# EAGLE design Comunicador-RS485 (EAGLE 9.6.2)
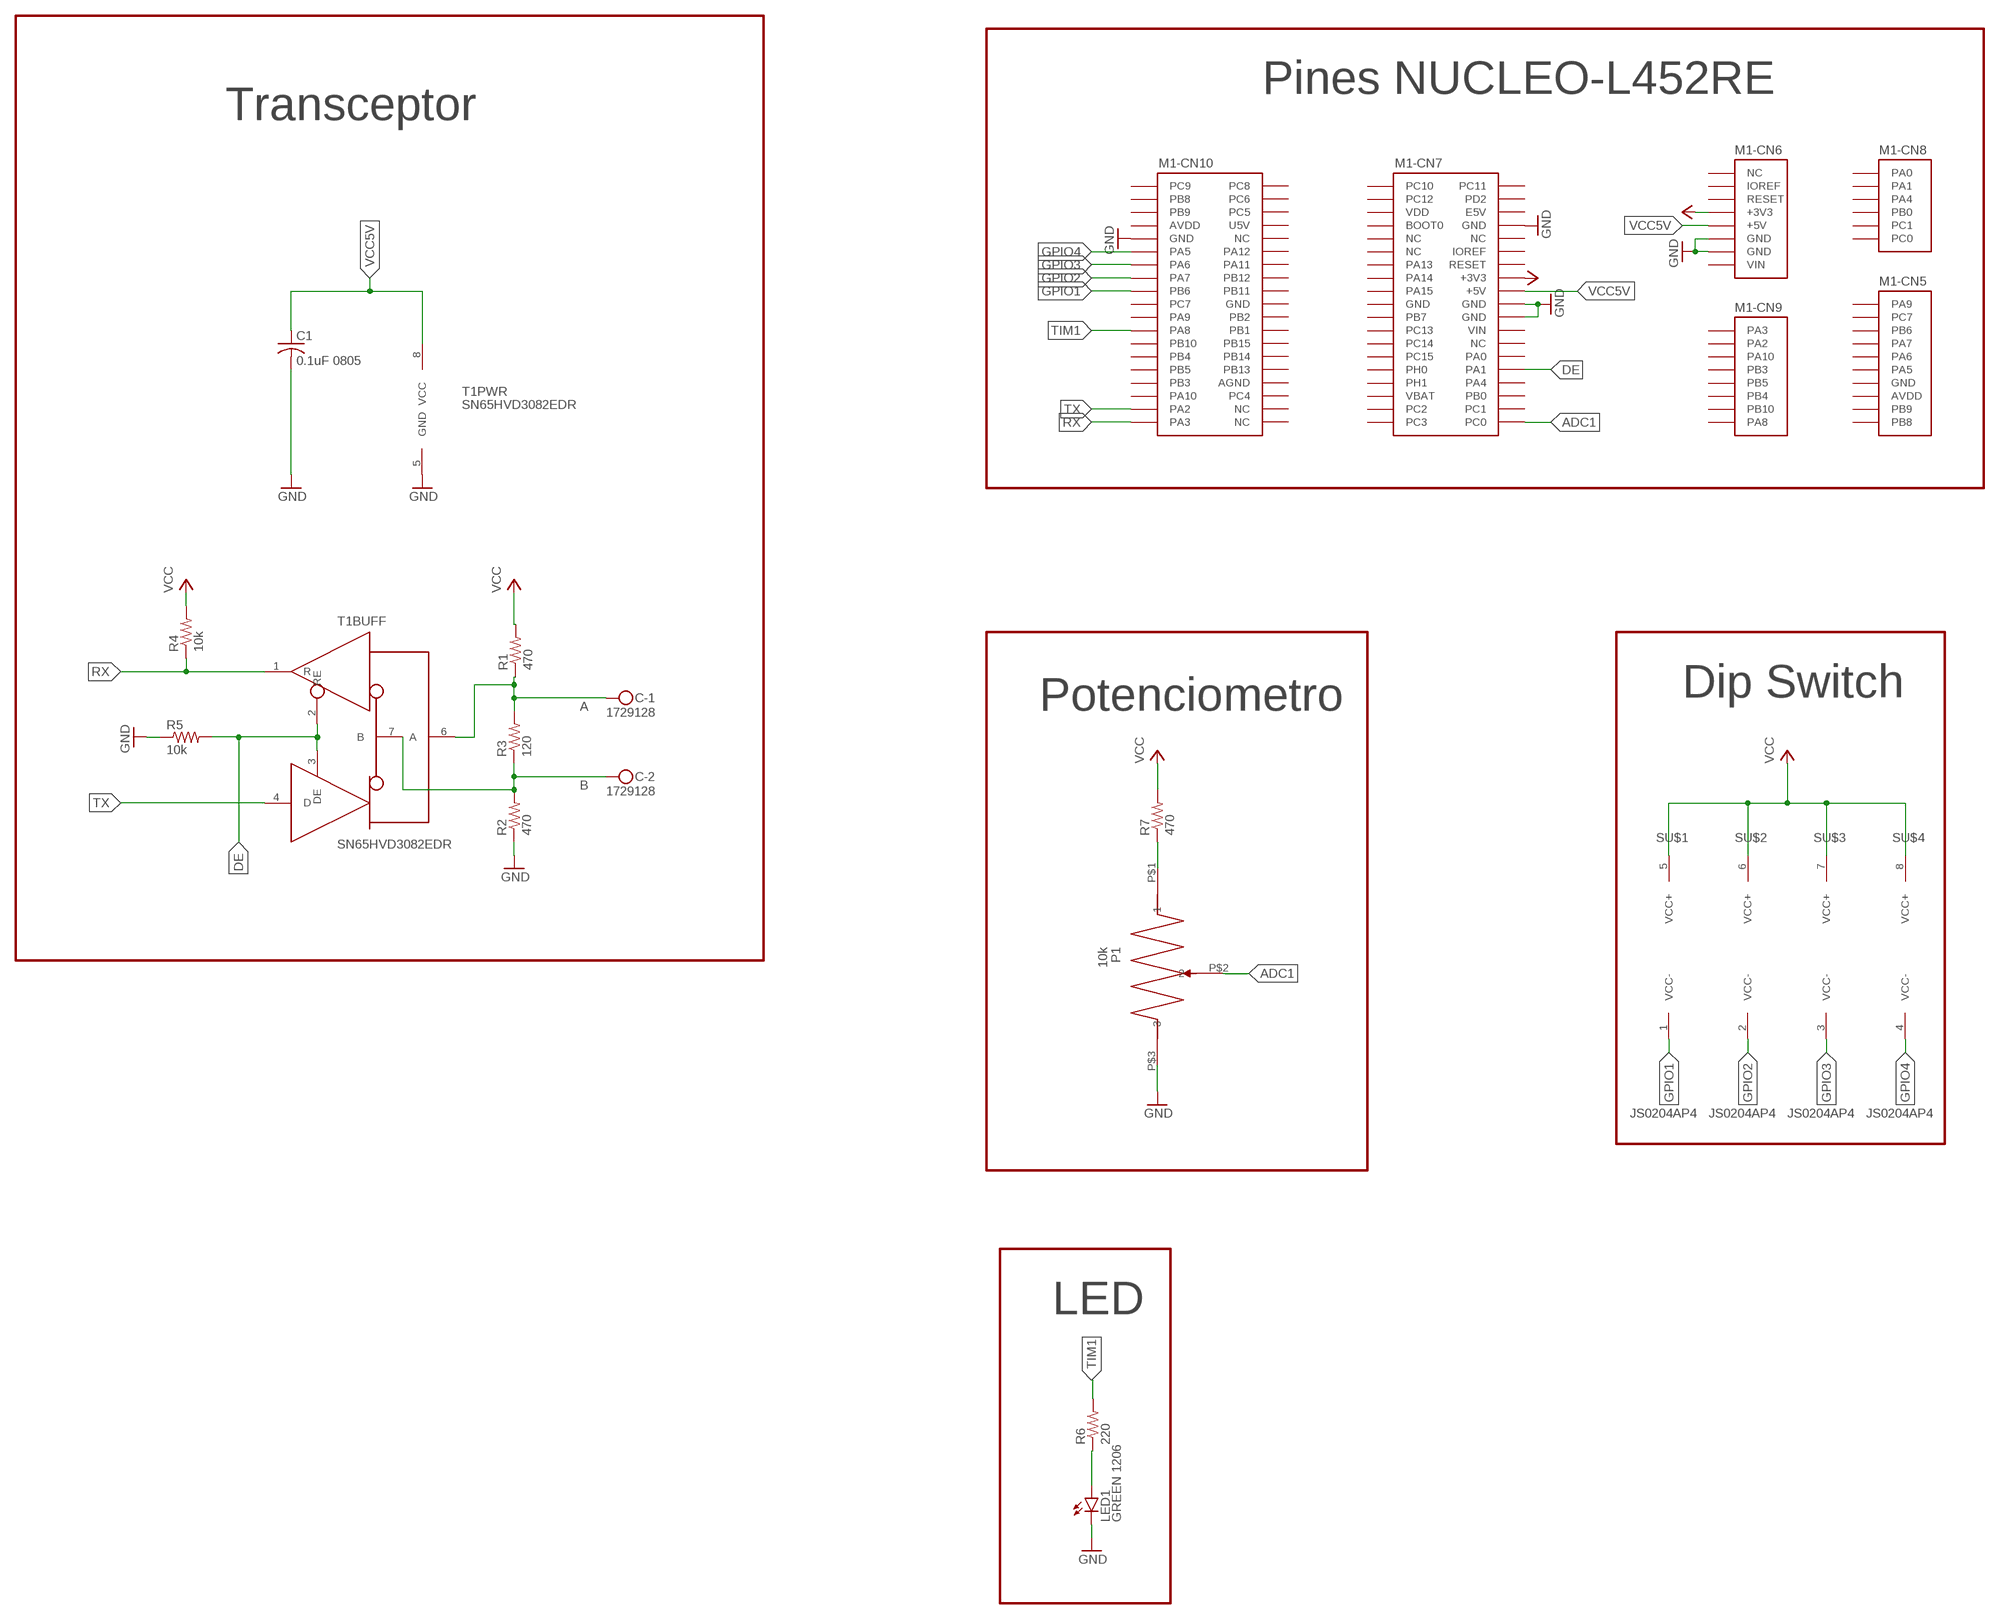
[diagram p0: schematic, sheet 1]

## Parts
C  1729128  MKDSN1,5/2-5,08  [MKDSN1,5/2-5,08]
C1  0.1uF 0805  C-USC0805  [C0805]
LED1  GREEN 1206  LEDCHIPLED_1206  [CHIPLED_1206]
M1  NUCLEO-L452RE  [NUCLEO-64]
P1  10k  PTV09A-4015U-B103  [PTV09A-4]
R1  470  R-US_R0805  [R0805]
R2  470  R-US_R0805  [R0805]
R3  120  R-US_R0805  [R0805]
R4  10k  R-US_R0805  [R0805]
R5  10k  R-US_R0805  [R0805]
R6  220  R-US_R0805  [R0805]
R7  470  R-US_R0805  [R0805]
S  JS0204AP4  [JS0204AP]
T1  SN65HVD3082EDR  [8-SOIC]

## Nets
A: C.1 R1.1 R3.2 T1.6(BUFF:A)
ADC1: M1.CN7-38(-CN7:PC0) P1.P$2
B: C.2 R2.2 R3.1 T1.7(BUFF:B)
DE: M1.CN7-30(-CN7:PA1) R5.2 T1.2(BUFF:RE) T1.3(BUFF:DE)
GND: C1.2 LED1.C M1.CN6-6(-CN6:GND) M1.CN6-7(-CN6:GND) M1.CN7-19(-CN7:GND) M1.CN7-20(-CN7:GND) M1.CN7-22(-CN7:GND) M1.CN10-9(-CN10:GND) P1.P$3 R2.1 R5.1 T1.5(PWR:GND)
GPIO1: M1.CN10-17(-CN10:PB6) S.1(U$1:VCC-)
GPIO2: M1.CN10-15(-CN10:PA7) S.2(U$2:VCC-)
GPIO3: M1.CN10-13(-CN10:PA6) S.3(U$3:VCC-)
GPIO4: M1.CN10-11(-CN10:PA5) S.4(U$4:VCC-)
N$1: LED1.A R6.1
N$14: P1.P$1 R7.1
RX: M1.CN10-37(-CN10:PA3) R4.1 T1.1(BUFF:R)
TIM1: M1.CN10-23(-CN10:PA8) R6.2
TX: M1.CN10-35(-CN10:PA2) T1.4(BUFF:D)
VCC: M1.CN6-4(-CN6:+3V3) M1.CN7-16(-CN7:+3V3) R1.2 R4.2 R7.2 S.5(U$1:VCC+) S.6(U$2:VCC+) S.7(U$3:VCC+) S.8(U$4:VCC+)
VCC5V: C1.1 M1.CN6-5(-CN6:+5V) M1.CN7-18(-CN7:+5V) T1.8(PWR:VCC)
Unconnected: M1.CN5-1(-CN5:PA9) M1.CN5-2(-CN5:PC7) M1.CN5-3(-CN5:PB6) M1.CN5-4(-CN5:PA7) M1.CN5-5(-CN5:PA6) M1.CN5-6(-CN5:PA5) M1.CN5-9(-CN5:PB9) M1.CN5-10(-CN5:PB8) M1.CN6-1(-CN6:NC) M1.CN6-3(-CN6:RESET) M1.CN7-1(-CN7:PC10) M1.CN7-2(-CN7:PC11) M1.CN7-3(-CN7:PC12) M1.CN7-4(-CN7:PD2) M1.CN7-6(-CN7:E5V) M1.CN7-7(-CN7:BOOT0) M1.CN7-9(-CN7:NC) M1.CN7-10(-CN7:NC) M1.CN7-11(-CN7:NC) M1.CN7-12(-CN7:IOREF) M1.CN7-13(-CN7:PA13) M1.CN7-14(-CN7:RESET) M1.CN7-15(-CN7:PA14) M1.CN7-17(-CN7:PA15) M1.CN7-21(-CN7:PB7) M1.CN7-23(-CN7:PC13) M1.CN7-25(-CN7:PC14) M1.CN7-26(-CN7:NC) M1.CN7-27(-CN7:PC15) M1.CN7-28(-CN7:PA0) M1.CN7-29(-CN7:PH0) M1.CN7-31(-CN7:PH1) M1.CN7-32(-CN7:PA4) M1.CN7-34(-CN7:PB0) M1.CN7-35(-CN7:PC2) M1.CN7-36(-CN7:PC1) M1.CN7-37(-CN7:PC3) M1.CN8-1(-CN8:PA0) M1.CN8-2(-CN8:PA1) M1.CN8-3(-CN8:PA4) M1.CN8-4(-CN8:PB0) M1.CN8-5(-CN8:PC1) M1.CN8-6(-CN8:PC0) M1.CN9-1(-CN9:PA3) M1.CN9-2(-CN9:PA2) M1.CN9-3(-CN9:PA10) M1.CN9-4(-CN9:PB3) M1.CN9-5(-CN9:PB5) M1.CN9-6(-CN9:PB4) M1.CN9-7(-CN9:PB10) M1.CN9-8(-CN9:PA8) M1.CN10-1(-CN10:PC9) M1.CN10-2(-CN10:PC8) M1.CN10-3(-CN10:PB8) M1.CN10-4(-CN10:PC6) M1.CN10-5(-CN10:PB9) M1.CN10-6(-CN10:PC5) M1.CN10-10(-CN10:NC) M1.CN10-12(-CN10:PA12) M1.CN10-14(-CN10:PA11) M1.CN10-16(-CN10:PB12) M1.CN10-18(-CN10:PB11) M1.CN10-19(-CN10:PC7) M1.CN10-21(-CN10:PA9) M1.CN10-22(-CN10:PB2) M1.CN10-24(-CN10:PB1) M1.CN10-25(-CN10:PB10) M1.CN10-26(-CN10:PB15) M1.CN10-27(-CN10:PB4) M1.CN10-28(-CN10:PB14) M1.CN10-29(-CN10:PB5) M1.CN10-30(-CN10:PB13) M1.CN10-31(-CN10:PB3) M1.CN10-33(-CN10:PA10) M1.CN10-34(-CN10:PC4) M1.CN10-36(-CN10:NC) M1.CN10-38(-CN10:NC)

## Notes on the sheet
- Pines NUCLEO-L452RE
- Transceptor
- Potenciometro | Dip Switch
- LED

## Power pins joined to a net without a drawn wire
AGND: M1.CN10-32(-CN10:AGND)
AVDD: M1.CN5-8(-CN5:AVDD) M1.CN10-7(-CN10:AVDD)
GND: M1.CN5-7(-CN5:GND) M1.CN7-8(-CN7:GND) M1.CN10-20(-CN10:GND)
IOREF: M1.CN6-2(-CN6:IOREF)
U5V: M1.CN10-8(-CN10:U5V)
VBAT: M1.CN7-33(-CN7:VBAT)
VDD: M1.CN7-5(-CN7:VDD)
VIN: M1.CN6-8(-CN6:VIN) M1.CN7-24(-CN7:VIN)

## Library data of the parts
C = 1729128 - PHOENIX CONTACT:MKDSN1,5/2-5,08: MKDSN 1,5/ 2-5,08 Printklemme Nennstrom: 13,5 A Nennspannung: 250 V Rastermaß: 5,08 mm Polzahl: 2 Anschlussart: Schraubanschluss Montage: Löten Anschlussrichtung Leiter/Platine: 0 ° Artikelnummer: 1729128 Source: http://eshop.phoenixcontact.com .. 1729128.pdf; PARTNO: 1729128
C1 = rcl:C-US: CAPACITOR, American symbol; PARTNO: 08053C104KAT2A; SPICEPREFIX: C
LED1 = QTLP650D4TR - Everlight Electronics:LED: LED OSRAM: - CHIPLED LG R971, LG N971, LY N971, LG Q971, LY Q971, LO R971, LY R971 LH N974, LH R974 LS Q976, LO Q976, LY Q976 LO Q996 - Hyper CHIPLED LW Q18S LB Q993, LB Q99A, LB R99A - SideLED LS A670, LO A670, LY A670, LG A670, LP A670 LB A673, LV A673, LT A673, LW A673 LH A674 LY A675 LS A676, LA A676, LO A676, LY A676, LW A676 LS A679, LY A679, LG A679 - Hyper Micro SIDELED® LS Y876, LA Y876, LO Y876, LY Y876 LT Y87S - SmartLED LW L88C, LW L88S LB L89C, LB L89S, LG L890 LS L89K, LO L89K, LY L89K LS L896, LA L896, LO L896, LY L896 - TOPLED LS T670, LO T670, LY T670, LG T670, LP T670 LSG T670, LSP T670, LSY T670, LOP T670, LYG T670 LG T671, LOG T671, LSG T671 LB T673, LV T673, LT T673, LW T673 LH T674 LS T676, LA T676, LO T676, LY T676, LB T676, LH T676, LSB T676, LW T676 LB T67C, LV T67C, LT T67C, LS T67K, LO T67K, LY T67K, LW E67C LS E67B, LA E67B, LO E67B, LY E67B, LB E67C, LV E67C, LT E67C LW T67C LS T679, LY T679, LG T679 LS T770, LO T770, LY T770, LG T770, LP T770 LB T773, LV T773, LT T773, LW T773 LH T774 LS E675, LA E675, LY E675, LS T675 LS T776, LA T776, LO T776, LY T776, LB T776 LHGB T686 LT T68C, LB T68C - Hyper Mini TOPLED® LB M676 - Mini TOPLED Santana® LG M470 LS M47K, LO M47K, LY M47K Source: http://www.osram.convergy.de LUXEON: - LUMILED® LXK2-PW12-R00, LXK2-PW12-S00, LXK2-PW14-U00, LXK2-PW14-V00 LXK2-PM12-R00, LXK2-PM12-S00, LXK2-PM14-U00 LXK2-PE12-Q00, LXK2-PE12-R00, LXK2-PE12-S00, LXK2-PE14-T00, LXK2-PE14-U00 LXK2-PB12-K00, LXK2-PB12-L00, LXK2-PB12-M00, LXK2-PB14-N00, LXK2-PB14-P00, LXK2-PB14-Q00 LXK2-PR12-L00, LXK2-PR12-M00, LXK2-PR14-Q00, LXK2-PR14-R00 LXK2-PD12-Q00, LXK2-PD12-R00, LXK2-PD12-S00 LXK2-PH12-R00, LXK2-PH12-S00 LXK2-PL12-P00, LXK2-PL12-Q00, LXK2-PL12-R00 Source: www.luxeon.com KINGBRIGHT: KA-3528ASYC Source: www.kingbright.com; PARTNO: CMD15-21VGD/TR8
M1 = NUCLEO-L452RE:NUCLEO-L452RE: No existe un outline (Layer Dimension) para esta librería. En su lugar se utilizó una referencia en tDocu. Al momento de diseñar la tarjeta, el Dimension debe ser dibujado según los requerimientos del usuario, o simplemente copiar los contenidos del tDocu en Dimensions.
P1 = PTV09A-4015U-B103 - BI:PTV09A-4015U-B103; PARTNO: PTV09A-4015U-B103
R1 R2 R7 = rcl:R-US_: RESISTOR, American symbol; PARTNO: AC0805FR-07470RL; SPICEPREFIX: R
R3 = rcl:R-US_: RESISTOR, American symbol; PARTNO: RC0805JR-13120RL; SPICEPREFIX: R
R4 R5 = rcl:R-US_: RESISTOR, American symbol; PARTNO: RC0805FR-0710KP; SPICEPREFIX: R
R6 = rcl:R-US_: RESISTOR, American symbol; PARTNO: AC0805FR-07220RL; SPICEPREFIX: R
S = JS0204AP4:JS0204AP4; PARTNO: JS0204AP4
T1 = SN65HVD3082EDR-TI:SN65HVD3082EDR; PARTNO: SN65HVD3082EDR

## Board
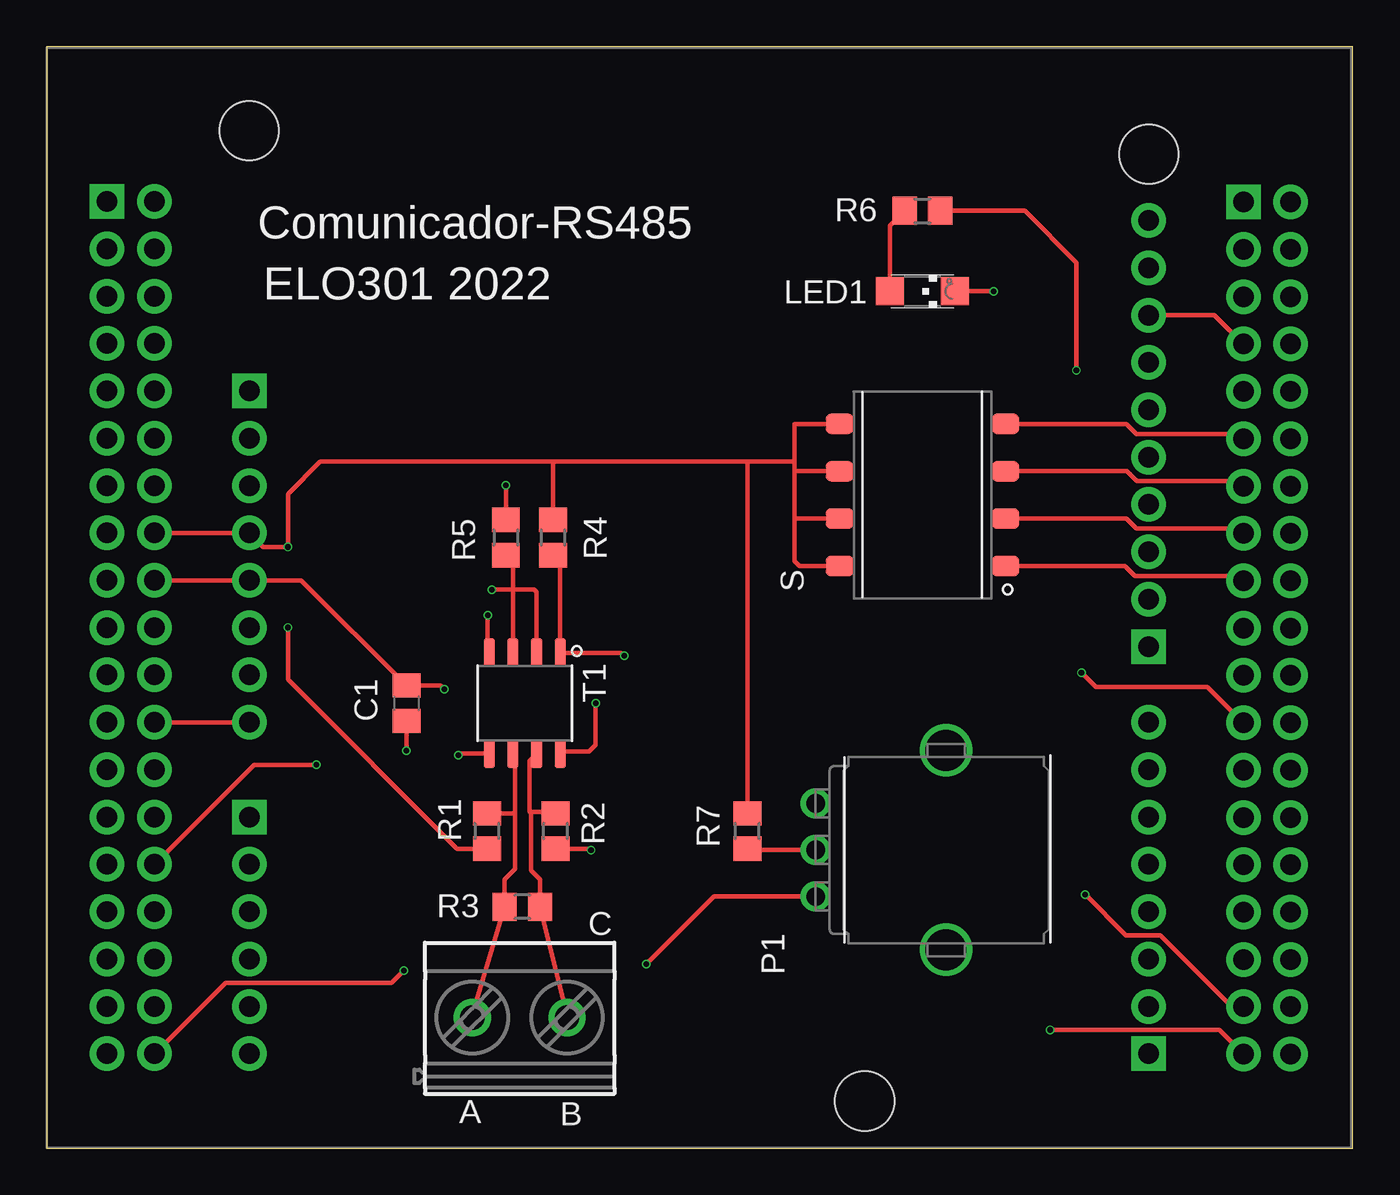
[diagram p1: board, top side]
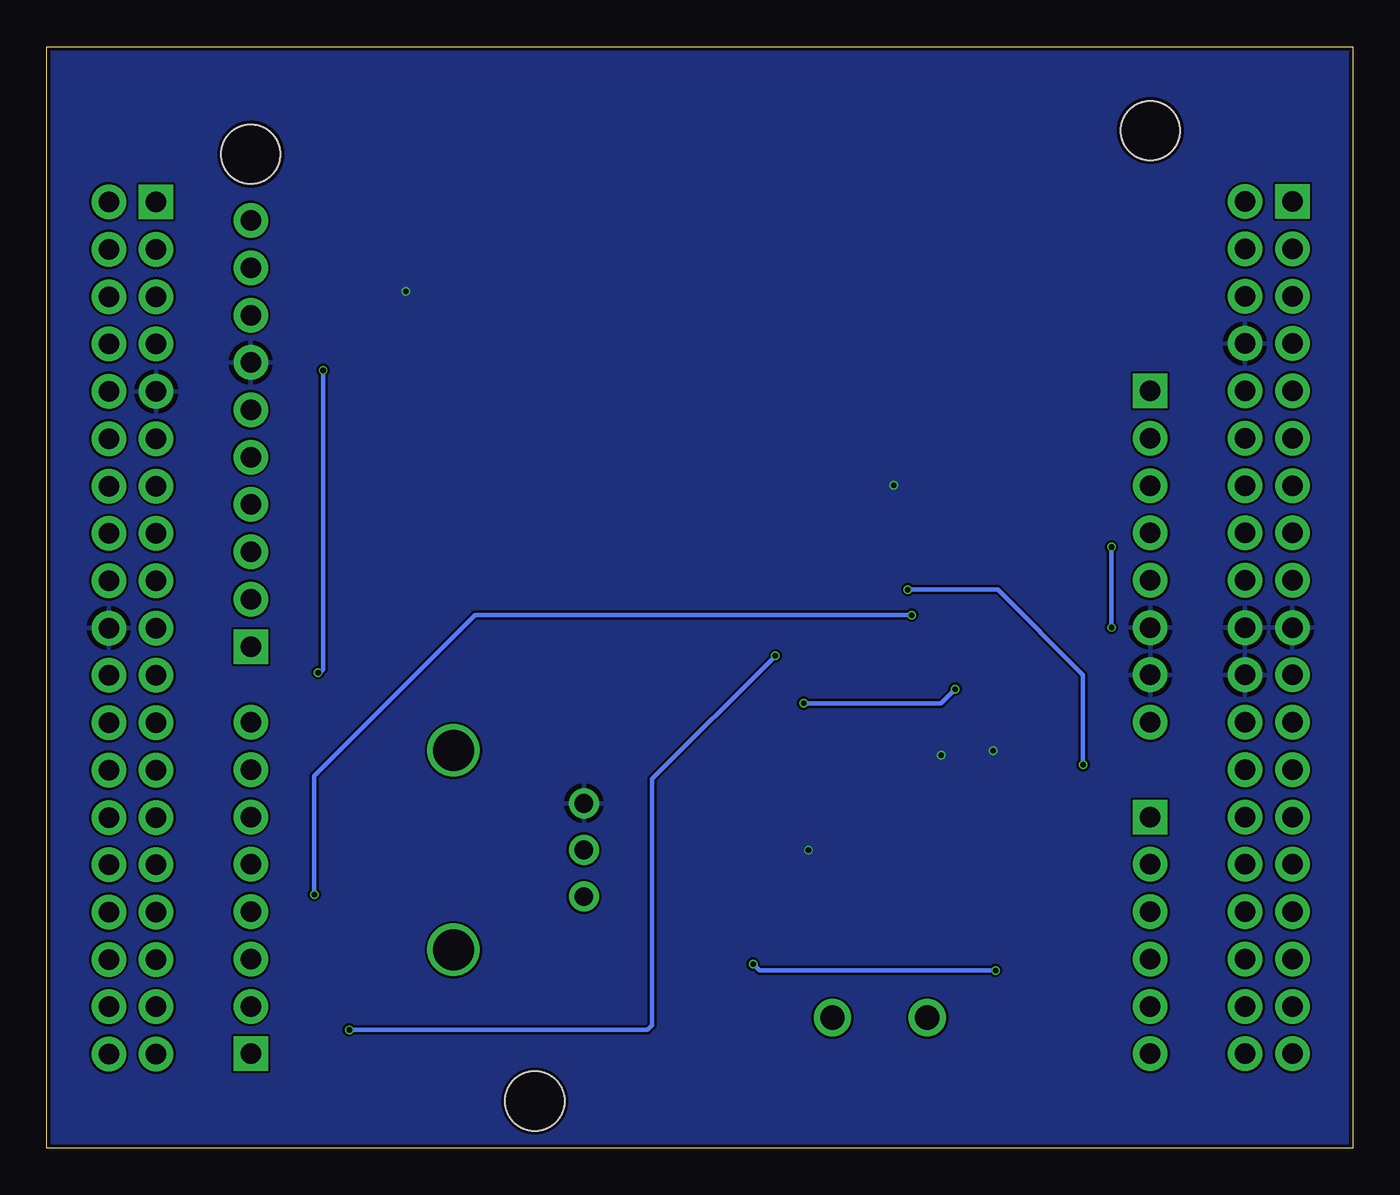
[diagram p2: board, bottom side, seen from below]

Size 70.08 x 59.11 mm. Coordinates in mm from the lower left corner, seen from the top.
Outline: 0,0 70.08,0 70.08,59.11 0,59.11 0,0
Copper layers (1*16): Top 0.035mm / dielectric 1.6mm / Bottom 0.035mm
Design rules "jlcpcb-2layers *": minimum track width 5mil, minimum drill 0.3mm, track to track 5mil, track to pad 5mil, pad to pad 5mil, via to via 5mil, smd to smd 5mil, copper to edge 0.2mm, drill to drill 6mil, minimum pad ring 10mil, minimum via ring 3mil, stop-mask expansion 4mil, vias tented up to drill 15mil, thermal gap 10mil

### Footprints (pad centres in the part's own frame; a part is rotated, then mirrored left to right if it is on the bottom)
MKDSN1,5/2-5,08 = drill 1.3 pad 2: 1 -2.561,0.025; 2 2.519,0.025
C0805 = smd 1.3 x 1.5: 1 -0.95,0; 2 0.95,0
CHIPLED_1206 = smd 1.5 x 1.5: A 0,-1.75; C 0,1.75
NUCLEO-64 = drill 1.1 pad 1.85 square: CN5-1 59.13,24.884; CN6-1 10.87,38.6; CN7-1 3.25,48.76; CN8-1 10.87,15.74; CN9-1 59.13,3.04; CN10-1 64.21,48.735 | drill 1.1 pad 1.85: CN5-2 59.13,27.424; CN5-3 59.13,29.964; CN5-4 59.13,32.504; CN5-5 59.13,35.044; CN5-6 59.13,37.584; CN5-7 59.13,40.124; CN5-8 59.13,42.664; CN5-9 59.13,45.204; CN5-10 59.13,47.744; CN6-2 10.87,36.06; CN6-3 10.87,33.52; CN6-4 10.87,30.98; CN6-5 10.87,28.44; CN6-6 10.87,25.9; CN6-7 10.87,23.36; CN6-8 10.87,20.82; CN7-2 5.79,48.76; CN7-3 3.25,46.22; CN7-4 5.79,46.22; CN7-5 3.25,43.68; CN7-6 5.79,43.68; CN7-7 3.25,41.14; CN7-8 5.79,41.14; CN7-9 3.25,38.6; CN7-10 5.79,38.6; CN7-11 3.25,36.06; CN7-12 5.79,36.06; CN7-13 3.25,33.52; CN7-14 5.79,33.52; CN7-15 3.25,30.98; CN7-16 5.79,30.98; CN7-17 3.25,28.44; CN7-18 5.79,28.44; CN7-19 3.25,25.9; CN7-20 5.79,25.9; CN7-21 3.25,23.36; CN7-22 5.79,23.36; CN7-23 3.25,20.82; CN7-24 5.79,20.82; CN7-25 3.25,18.28; CN7-26 5.79,18.28; CN7-27 3.25,15.74; CN7-28 5.79,15.74; CN7-29 3.25,13.2; CN7-30 5.79,13.2; CN7-31 3.25,10.66; CN7-32 5.79,10.66; CN7-33 3.25,8.12; CN7-34 5.79,8.12; CN7-35 3.25,5.58; CN7-36 5.79,5.58; CN7-37 3.25,3.04; CN7-38 5.79,3.04; CN8-2 10.87,13.2; CN8-3 10.87,10.66; CN8-4 10.87,8.12; CN8-5 10.87,5.58; CN8-6 10.87,3.04; CN9-2 59.13,5.58; CN9-3 59.13,8.12; CN9-4 59.13,10.66; CN9-5 59.13,13.2; CN9-6 59.13,15.74; CN9-7 59.13,18.28; CN9-8 59.13,20.82; CN10-2 66.75,48.735; CN10-3 64.21,46.195; CN10-4 66.75,46.195; CN10-5 64.21,43.655; CN10-6 66.75,43.655; CN10-7 64.21,41.115; CN10-8 66.75,41.115; CN10-9 64.21,38.575; CN10-10 66.75,38.575; CN10-11 64.21,36.035; CN10-12 66.75,36.035; CN10-13 64.21,33.495; CN10-14 66.75,33.495; CN10-15 64.21,30.955; CN10-16 66.75,30.955; CN10-17 64.21,28.415; CN10-18 66.75,28.415; CN10-19 64.21,25.875; CN10-20 66.75,25.875; CN10-21 64.21,23.335; CN10-22 66.75,23.335; CN10-23 64.21,20.795; CN10-24 66.75,20.795; CN10-25 64.21,18.255; CN10-26 66.75,18.255; CN10-27 64.21,15.715; CN10-28 66.75,15.715; CN10-29 64.21,13.175; CN10-30 66.75,13.175; CN10-31 64.21,10.635; CN10-32 66.75,10.635; CN10-33 64.21,8.095; CN10-34 66.75,8.095; CN10-35 64.21,5.555; CN10-36 66.75,5.555; CN10-37 64.21,3.015; CN10-38 66.75,3.015 | hole 3.175: 59.13,51.3; 10.87,52.57; 43.89,0.5
PTV09A-4 = drill 1.006 pad 1.606: P$1 0,-7; P$2 2.5,-7; P$3 -2.5,-7 | drill 2.203 pad 2.803: P$4 -5.35,0; P$5 5.35,0
R0805 = smd 1.3 x 1.5: 1 -0.95,0; 2 0.95,0
JS0204AP = smd 1.092 x 1.499: 1 -3.81,-4.445; 2 -1.27,-4.445; 3 1.27,-4.445; 4 3.81,-4.445; 5 -3.81,4.445; 6 -1.27,4.445; 7 1.27,4.445; 8 3.81,4.445
8-SOIC = smd 1.549 x 0.61: 1 -2.705,1.905; 2 -2.705,0.635; 3 -2.705,-0.635; 4 -2.705,-1.905; 5 2.705,-1.905; 6 2.705,-0.635; 7 2.705,0.635; 8 2.705,1.905

### Placement (x,y rotation side)
C  25.4,6.98 0 top
C1  19.3,23.88 270 top
LED1  46.99,45.97 270 top
M1  0,2.03 0 top
P1  48.26,16 270 top
R1  23.62,17.02 270 top
R2  27.3,17.02 90 top
R3  25.53,12.96 180 top
R4  27.18,32.77 90 top
R5  24.64,32.77 270 top
R6  46.99,50.29 0 top
R7  37.59,17.02 90 top
S  46.99,35.05 90 top
T1  25.65,23.88 270 top

### Tracks (layer width: path | path; a pad name or v marks a point on that pad's centre or on a via)
A
  Top 0.254: C.1 22.84,7.14 R3.2 24.58,14.42 25.15,14.99 25.15,18.03 | 25.15,18.03 25.15,21.04 T1.6 | 25.15,18.03 25.08,17.97 R1.1
ADC1  (via drill 0.3)
  Top 0.254: P1.P$2 35.8,13.5 v32.18,9.88 | M1.CN7-38 9.6,8.88 18.52,8.88 v19.18,9.54
  Bottom 0.254: v19.18,9.54 31.84,9.54 v32.18,9.88
AVDD
  Top 0.254: M1.CN10-7 62.66,44.7 M1.CN5-8
B
  Top 0.254: C.2 27.92,7.14 R3.1 26.48,14.42 25.98,14.91 25.98,18.03 | T1.7 25.91,20.79 25.91,18.03 25.98,18.03 | 25.98,18.03 27.24,18.03 R2.2
DE  (via drill 0.3)
  Top 0.254: T1.3 25.02,29.97 | 25.02,29.97 25.02,31.43 R5.2 | 25.02,29.97 v23.88,29.97 | v14.48,20.57 11.13,20.57 M1.CN7-30 | 25.02,29.97 26.16,29.97 26.29,29.84 T1.2
  Bottom 0.254: v23.88,29.97 19.05,29.97 14.48,25.4 v14.48,20.57
GND  (via drill 0.3)
  Top 0.254: LED1.C v50.8,45.97 | R5.1 v24.64,35.56 | C1.2 v19.3,21.34 | T1.5 22.19,21.17 v22.1,21.08 | R2.1 29.14,16.07 v29.21,16
  pour Bottom: 0,0 70.1,0 70.1,58.93 0,58.93 0,0.25
GPIO1
  Top 0.254: S.1 57.85,31.24 58.39,30.7 63.95,30.7 M1.CN10-17
GPIO2
  Top 0.254: S.2 57.94,33.78 58.46,33.26 63.94,33.26 M1.CN10-15
GPIO3
  Top 0.254: S.3 57.95,36.32 58.49,35.78 63.95,35.78 M1.CN10-13
GPIO4
  Top 0.254: M1.CN10-11 63.95,38.32 58.46,38.32 57.92,38.86 S.4
N$1
  Top 0.254: LED1.A 45.24,49.49 R6.1
N$14
  Top 0.254: P1.P$1 37.66,16 R7.1
RX  (via drill 0.3)
  Top 0.254: R4.1 27.56,31.43 T1.1 30.82,26.58 v30.99,26.42 | v53.85,6.35 62.91,6.35 M1.CN10-37
  Bottom 0.254: v30.99,26.42 37.59,19.81 37.59,6.6 37.85,6.35 v53.85,6.35
TIM1  (via drill 0.3)
  Top 0.254: R6.2 52.48,50.29 55.25,47.52 v55.25,41.73 | v55.52,25.52 56.28,24.75 62.28,24.75 M1.CN10-23
  Bottom 0.254: v55.25,41.73 55.25,25.7 55.47,25.47 v55.52,25.52
TX  (via drill 0.3)
  Top 0.254: T1.4 23.67,26.66 v23.67,28.6 | v55.72,13.61 57.91,11.43 59.75,11.43 63.58,7.59 M1.CN10-35
  Bottom 0.254: v23.67,28.6 47.1,28.6 55.72,19.98 v55.72,13.61
VCC  (via drill 0.3)
  Top 0.254: R4.2 27.18,36.83 | 27.18,36.83 14.69,36.83 12.95,35.1 v12.95,32.26 11.62,32.26 M1.CN6-4 M1.CN7-16 | S.8 40.13,38.86 40.13,36.83 | 40.13,36.83 40.13,36.32 | 40.13,36.32 S.7 | 40.13,36.32 40.13,33.78 | 40.13,33.78 S.6 | 40.13,33.78 40.13,31.5 40.39,31.24 S.5 | 27.18,36.83 37.59,36.83 | 37.59,36.83 40.13,36.83 | R1.2 22.03,16.07 12.95,25.15 v12.95,27.94 | R7.2 37.59,36.83
  Bottom 0.254: v12.95,27.94 v12.95,32.26
VCC5V  (via drill 0.3)
  Top 0.254: v21.34,24.64 21.15,24.83 C1.1 13.66,30.47 M1.CN6-5 M1.CN7-18 | T1.8 27.67,21.29 29.1,21.29 29.46,21.65 v29.46,23.88
  Bottom 0.254: v21.34,24.64 22.1,23.88 v29.46,23.88
VIN
  Top 0.254: M1.CN7-24 M1.CN6-8

### Text on the board
tPlace: Comunicador-RS485 | ELO301 2022 | A | B